# EAGLE schematic Esquematico (EAGLE 9.5.2)
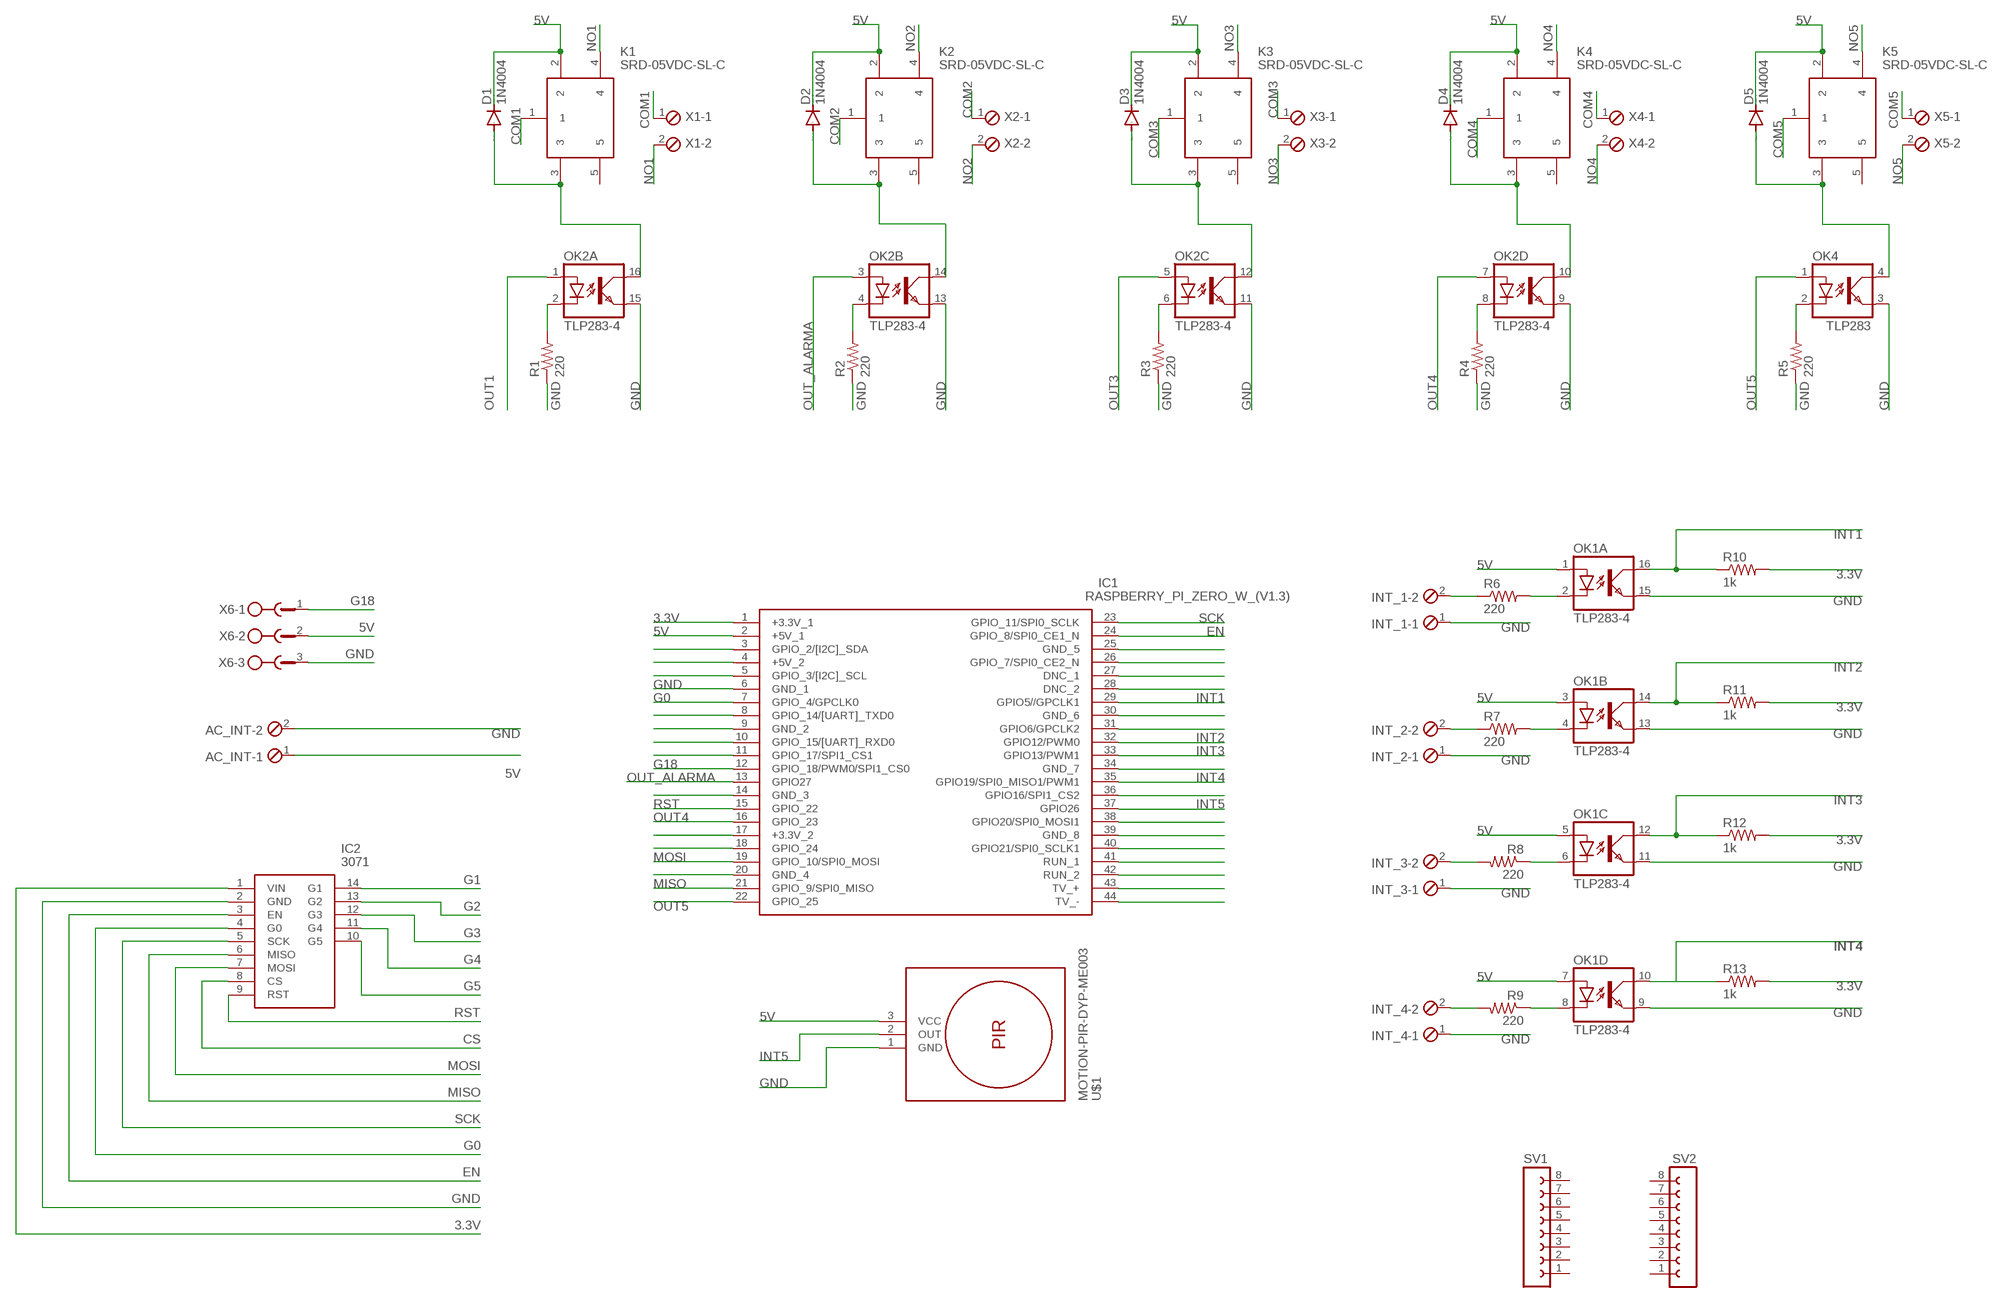
[diagram p0: schematic, sheet 1]

## Parts
AC_INT  MPT2  [2POL254]
D1  1N4004  [DO41-10]
D2  1N4004  [DO41-10]
D3  1N4004  [DO41-10]
D4  1N4004  [DO41-10]
D5  1N4004  [DO41-10]
IC1  RASPBERRY_PI_ZERO_W_(V1.3)  [RASPBERRYPIZEROWV13]
IC2  3071  [3071]
INT_1  MPT2  [2POL254]
INT_2  MPT2  [2POL254]
INT_3  MPT2  [2POL254]
INT_4  MPT2  [2POL254]
K1  SRD-05VDC-SL-C  [SRD]
K2  SRD-05VDC-SL-C  [SRD]
K3  SRD-05VDC-SL-C  [SRD]
K4  SRD-05VDC-SL-C  [SRD]
K5  SRD-05VDC-SL-C  [SRD]
OK1  TLP283-4  [MINI-FLAT-16]
OK2  TLP283-4  [MINI-FLAT-16]
OK4  TLP283  [MINI-FLAT-4]
R1  220  R-US_R0402  [R0402]
R2  220  R-US_R0402  [R0402]
R3  220  R-US_R0402  [R0402]
R4  220  R-US_R0402  [R0402]
R5  220  R-US_R0402  [R0402]
R6  220  R-US_R0402  [R0402]
R7  220  R-US_R0402  [R0402]
R8  220  R-US_R0402  [R0402]
R9  220  R-US_R0402  [R0402]
R10  1k  R-US_R0402  [R0402]
R11  1k  R-US_R0402  [R0402]
R12  1k  R-US_R0402  [R0402]
R13  1k  R-US_R0402  [R0402]
SV1  FE08W  [FE08W]
SV2  FE08W  [FE08W]
U$1  MOTION-PIR-DYP-ME003  [MOTION-PIR-DYP-ME003]
X1  MPT2  [2POL254]
X2  MPT2  [2POL254]
X3  MPT2  [2POL254]
X4  MPT2  [2POL254]
X5  MPT2  [2POL254]
X6  W232-3  [W232-3]

## Nets
3.3V: IC1.1(+3.3V_1) IC2.1(VIN) R10.2 R11.2 R12.2 R13.2
5V: AC_INT.1 D1.C D2.C D3.C D4.C D5.C IC1.2(+5V_1) K1.2 K2.2 K3.2 K4.2 K5.2 OK1.1(A:A) OK1.3(B:A) OK1.5(C:A) OK1.7(D:A) U$1.3(VCC) X6.2
COM1: K1.1 X1.1
COM2: K2.1 X2.1
COM3: K3.1 X3.1
COM4: K4.1 X4.1
COM5: K5.1 X5.1
CS: IC2.8(CS)
EN: IC1.24(GPIO_8/SPI0_CE1_N) IC2.3(EN)
G0: IC1.7(GPIO_4/GPCLK0) IC2.4(G0)
G1: IC2.14(G1)
G2: IC2.13(G2)
G3: IC2.12(G3)
G4: IC2.11(G4)
G5: IC2.10(G5)
G18: IC1.12(GPIO_18/PWM0/SPI1_CS0) X6.1
GND: AC_INT.2 IC1.6(GND_1) IC2.2(GND) INT_1.1 INT_2.1 INT_3.1 INT_4.1 OK1.9(D:EMIT) OK1.11(C:EMIT) OK1.13(B:EMIT) OK1.15(A:EMIT) OK2.9(D:EMIT) OK2.11(C:EMIT) OK2.13(B:EMIT) OK2.15(A:EMIT) OK4.3(EMIT) R1.1 R2.1 R3.1 R4.1 R5.1 U$1.1(GND) X6.3
INT1: IC1.29(GPIO5//GPCLK1) OK1.16(A:COL) R10.1
INT2: IC1.32(GPIO12/PWM0) OK1.14(B:COL) R11.1
INT3: IC1.33(GPIO13/PWM1) OK1.12(C:COL) R12.1
INT4: IC1.35(GPIO19/SPI0_MISO1/PWM1) OK1.10(D:COL) R13.1
INT5: IC1.37(GPIO26) U$1.2(OUT)
MISO: IC1.21(GPIO_9/SPI0_MISO) IC2.6(MISO)
MOSI: IC1.19(GPIO_10/SPI0_MOSI) IC2.7(MOSI)
N$1: IC1.3(GPIO_2/[I2C]_SDA)
N$2: IC1.4(+5V_2)
N$3: INT_1.2 R6.1
N$4: OK1.2(A:C) R6.2
N$5: IC1.5(GPIO_3/[I2C]_SCL)
N$6: IC1.8(GPIO_14/[UART]_TXD0)
N$7: IC1.9(GND_2)
N$8: IC1.10(GPIO_15/[UART]_RXD0)
N$9: INT_2.2 R7.1
N$10: OK2.2(A:C) R1.2
N$11: OK2.4(B:C) R2.2
N$12: OK2.6(C:C) R3.2
N$13: OK2.8(D:C) R4.2
N$14: OK4.2(C) R5.2
N$15: OK1.4(B:C) R7.2
N$16: INT_3.2 R8.2
N$17: OK1.6(C:C) R8.1
N$18: INT_4.2 R9.2
N$19: OK1.8(D:C) R9.1
N$20: IC1.11(GPIO_17/SPI1_CS1)
N$22: IC1.14(GND_3)
N$23: IC1.17(+3.3V_2)
N$24: IC1.18(GPIO_24)
N$26: IC1.20(GND_4)
N$29: IC1.25(GND_5)
N$30: D5.A K5.3 OK4.4(COL)
N$31: IC1.26(GPIO_7/SPI0_CE2_N)
N$32: D4.A K4.3 OK2.10(D:COL)
N$33: D3.A K3.3 OK2.12(C:COL)
N$34: D2.A K2.3 OK2.14(B:COL)
N$35: D1.A K1.3 OK2.16(A:COL)
N$36: IC1.27(DNC_1)
N$37: IC1.28(DNC_2)
N$38: IC1.30(GND_6)
N$39: IC1.31(GPIO6/GPCLK2)
N$40: IC1.34(GND_7)
N$41: IC1.36(GPIO16/SPI1_CS2)
N$42: IC1.38(GPIO20/SPI0_MOSI1)
N$43: IC1.39(GND_8)
N$44: IC1.40(GPIO21/SPI0_SCLK1)
N$45: IC1.41(RUN_1)
N$46: IC1.42(RUN_2)
N$47: IC1.43(TV_+)
N$48: IC1.44(TV_-)
NO1: K1.4 X1.2
NO2: K2.4 X2.2
NO3: K3.4 X3.2
NO4: K4.4 X4.2
NO5: K5.4 X5.2
OUT1: OK2.1(A:A)
OUT3: OK2.5(C:A)
OUT4: IC1.16(GPIO_23) OK2.7(D:A)
OUT5: IC1.22(GPIO_25) OK4.1(A)
OUT_ALARMA: IC1.13(GPIO27) OK2.3(B:A)
RST: IC1.15(GPIO_22) IC2.9(RST)
SCK: IC1.23(GPIO_11/SPI0_SCLK) IC2.5(SCK)
Unconnected: K1.5 K2.5 K3.5 K4.5 K5.5 SV1.1 SV1.2 SV1.3 SV1.4 SV1.5 SV1.6 SV1.7 SV1.8 SV2.1 SV2.2 SV2.3 SV2.4 SV2.5 SV2.6 SV2.7 SV2.8

## Library data of the parts
AC_INT INT_1-INT_4 X1-X5 = con-phoenix-254:MPT2: PHOENIX CONNECTOR; OC_FARNELL: unknown; OC_NEWARK: unknown
D1-D5 = diode:1N4004: DIODE general purpose rectifier, 1 A
IC1 = Raspberry_Pi_Zero_W_(v1.3):RASPBERRY_PI_ZERO_W_(V1.3): Raspberry Pi Zero W (v1.3) Single-board Computers Source: Datasheet <https://cdn.sparkfun.com/assets/learn_tutorials/6/7/6/PiZero_1.pdf>; DESCRIPTION: Raspberry Pi Zero W (v1.3) Single-board Computers; HEIGHT: mm; MANUFACTURER_NAME: RASPBERRY-PI; MANUFACTURER_PART_NUMBER: Raspberry Pi Zero W (v1.3)
IC2 = 3071:3071: LoRa Packet Radio Breakout Source: Datasheet <https://learn.adafruit.com/downloads/pdf/adafruit-rfm69hcw-and-rfm96-rfm95-rfm98-lora-packet-padio-breakouts.pdf>; ALLIED_NUMBER: 70928125; ALLIED_PRICE-STOCK: https://www.alliedelec.com/adafruitindustries-3071/70928125/; DESCRIPTION: LoRa Packet Radio Breakout; HEIGHT: 3.5mm; MANUFACTURER_NAME: Adafruit; MANUFACTURER_PART_NUMBER: 3071; MOUSER_PART_NUMBER: 485-3071; MOUSER_PRICE-STOCK: https://www.mouser.com/Search/Refine.aspx?Keyword=485-3071
K1-K5 = SRD-05VDC-SL-C:SRD-05VDC-SL-C: Relay Source: Datasheet <http://files.microjpm.webnode.com/200001010-dda41de9e1/Songle Relay Datasheet.pdf>; DESCRIPTION: Relay; HEIGHT: mm; MANUFACTURER_NAME: Songle Relay; MANUFACTURER_PART_NUMBER: SRD-05VDC-SL-C
OK1 OK2 = optocoupler:TLP283-4: TOSHIBA PHOTOCOUPLER GaAs IRED & PHOTO-TRANSISTOR Source: http://www.semicon.toshiba.co.jp/td/en/Opto/Photocoupler/en_20050928_TLP283_datasheet.pdf; OC_FARNELL: unknown; OC_NEWARK: unknown
OK4 = optocoupler:TLP283: TOSHIBA PHOTOCOUPLER GaAs IRED & PHOTO-TRANSISTOR Source: http://www.semicon.toshiba.co.jp/td/en/Opto/Photocoupler/en_20050928_TLP283_datasheet.pdf; OC_FARNELL: unknown; OC_NEWARK: unknown
R1-R13 = rcl:R-US_: RESISTOR, American symbol; SPICEPREFIX: R
SV1 SV2 = con-lsta:FE08W: FEMALE HEADER; OC_FARNELL: unknown; OC_NEWARK: unknown
U$1 = diy-modules:MOTION-PIR-DYP-ME003: PIR Motion Sensor Module DYP-ME003 based on BISS0001 pyroelectic detector Click here to find device on ebay.com <http://www.ebay.com/sch/dyp+me003>
X6 = con-wago-508:W232-3: WAGO SREW CLAMP; OC_FARNELL: unknown; OC_NEWARK: unknown